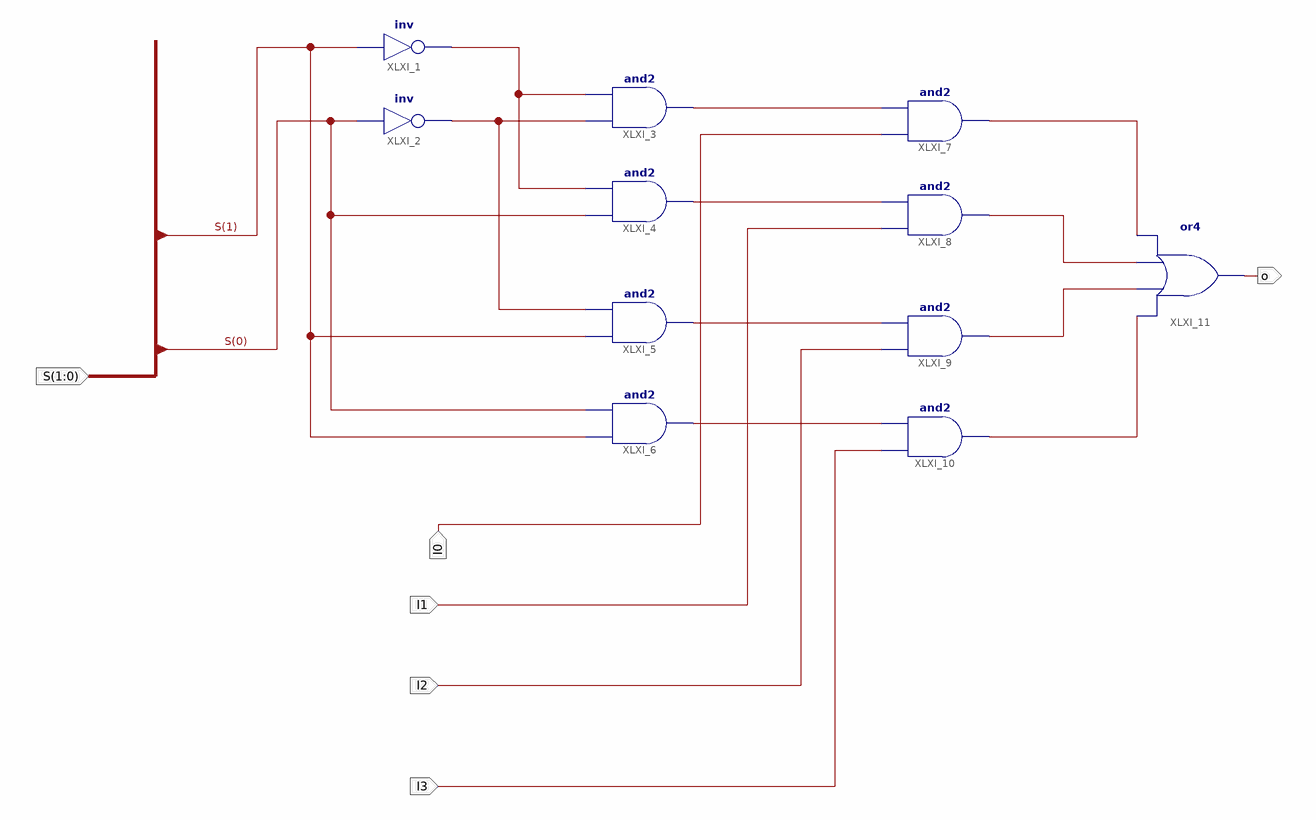
[diagram p0: schematic sheet 1]
// Xilinx ISE schematic MUX4to1.sch (kintex7) as structural Verilog: 11 symbols, 6 ports
module MUX4to1 (
  input  [1:0] S,
  input  I0,
  input  I1,
  input  I2,
  input  I3,
  output o
);

  wire XLXN_7, XLXN_8, XLXN_13, XLXN_14, XLXN_15, XLXN_16, XLXN_27, XLXN_28, XLXN_29, XLXN_30;

  not XLXI_1 (XLXN_7, S[1]);
  not XLXI_2 (XLXN_8, S[0]);
  and XLXI_3 (XLXN_13, XLXN_8, XLXN_7);
  and XLXI_4 (XLXN_14, S[0], XLXN_7);
  and XLXI_5 (XLXN_15, S[1], XLXN_8);
  and XLXI_6 (XLXN_16, S[1], S[0]);
  and XLXI_7 (XLXN_27, I0, XLXN_13);
  and XLXI_8 (XLXN_28, I1, XLXN_14);
  and XLXI_9 (XLXN_29, I2, XLXN_15);
  and XLXI_10 (XLXN_30, I3, XLXN_16);
  or XLXI_11 (o, XLXN_30, XLXN_29, XLXN_28, XLXN_27);
endmodule
